# Altium schematic sheet 5-VOL_CHECK.SchDoc: RD15002_SingleSCT.PrjPcb
size A4; DrawnBy: 邓勇杰; Revision: A1.0.0; SheetNumber: 6; SheetTotal: 10; Time: 2015/12/2
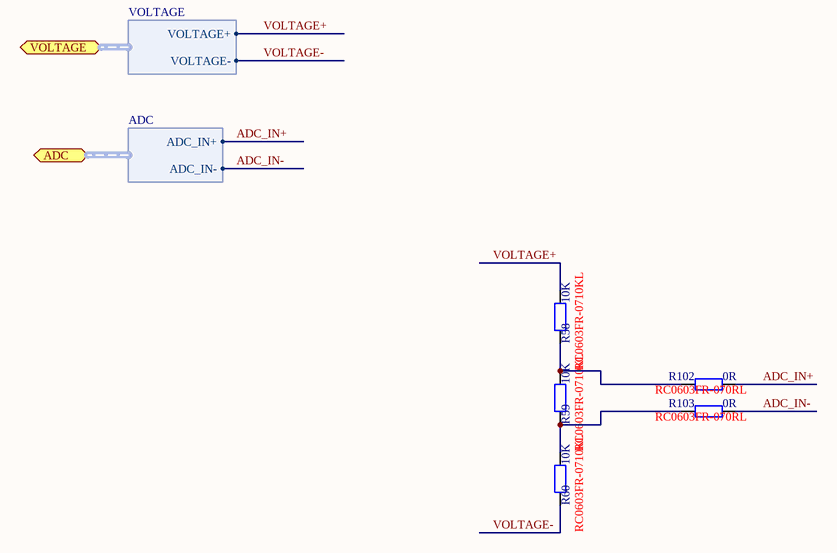
[diagram p0: 5-VOL_CHECK.SchDoc]

## Parts
R58  10K  Type No.: RC0603FR-0710KL  [CC0603]
R59  10K  Type No.: RC0603FR-0710KL  [CC0603]
R60  10K  Type No.: RC0603FR-0710KL  [CC0603]
R102  0R  Type No.: RC0603FR-070RL  [CC0603]
R103  0R  Type No.: RC0603FR-070RL  [CC0603]

## Ports
ADC (harness ADC), VOLTAGE (harness VOLTAGE)

## Harnesses
VOLTAGE: VOLTAGE+, VOLTAGE-
ADC: ADC_IN+, ADC_IN-

## Nets
ADC_IN+: R102.1 ; port ADC.ADC_IN+
ADC_IN-: R103.1 ; port ADC.ADC_IN-
VOLTAGE+: R58.1 ; port VOLTAGE.VOLTAGE+
VOLTAGE-: R60.2 ; port VOLTAGE.VOLTAGE-
NetR58_2: R58.2 R59.1 R102.2
NetR59_2: R59.2 R60.1 R103.2

## Notes on the sheet
- 文件版本:
- 原理图名:
- 工 程  名:
- 绘       制:
- 审       核:
- 第   页，共    页
- 日       期:

## Library data of the parts
R58-R60 R102 R103 = Res2: Resistor